# EAGLE design oshi-fuse-board-mk-1_mini-ato (EAGLE 6.5.0)
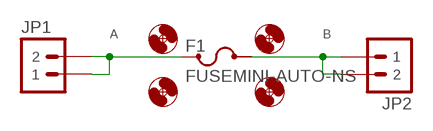
[diagram p0: schematic, sheet 1]

## Parts
F1  FUSEMINI-AUTO-NS  [KEYSTONE-MINI-AUTO-FUSE-HOLDER-NS]
H1  HOLE#2  [HOLE-#2]
H2  HOLE#2  [HOLE-#2]
H3  HOLE#2  [HOLE-#2]
H4  HOLE#2  [HOLE-#2]
JP1  M023.5MM  [SCREWTERMINAL-3.5MM-2]
JP2  M023.5MM  [SCREWTERMINAL-3.5MM-2]

## Nets
A: F1.P1@1 F1.P1@2 JP1.1 JP1.2
B: F1.P2@1 F1.P2@2 JP2.1 JP2.2

## Library data of the parts
F1 = A_butts:FUSE
H1-H4 = A_butts:HOLE: MOUNTING HOLE with drill center marker
JP1 JP2 = A_butts:M02: Standard 2-pin 0.1" header. Use with - straight break away headers ( PRT-00116) - right angle break away headers (PRT-00553) - swiss pins (PRT-00743) - machine pins (PRT-00117) - female headers (PRT-00115) Molex polarized connector foot print use with: PRT-08233 with associated crimp pins and housings. 2.54_SCREWTERM for use with PRT-10571. 3.5mm Screw Terminal footprints for PRT-08084 5mm Screw Terminal footprints for use with PRT-08433

## Board
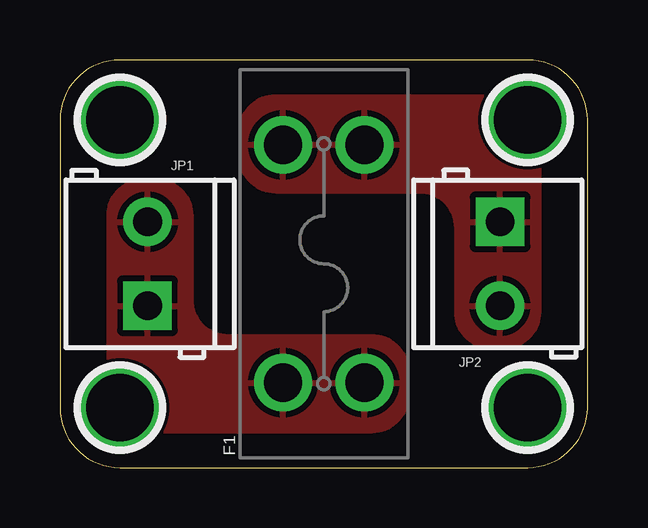
[diagram p1: board, top side]
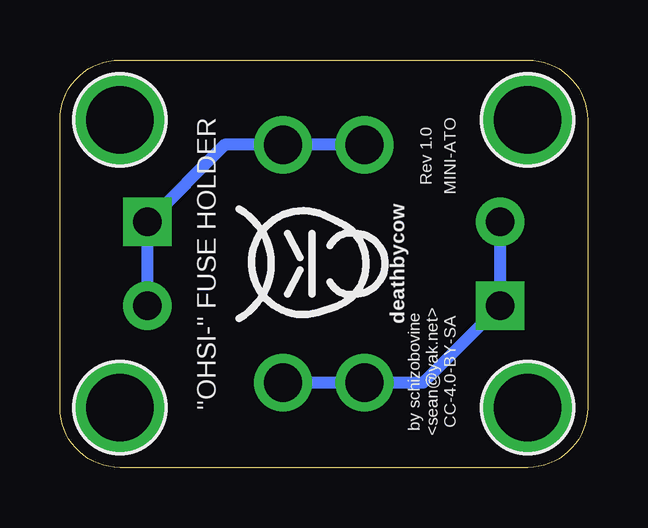
[diagram p2: board, bottom side, seen from below]

Size 22 x 17 mm. Coordinates in mm from the lower left corner, seen from the top.
Outline: 0,14.5 0,2.5 arc90 2.5,0 19.5,0 arc90 22,2.5 22,14.5 arc90 19.5,17 2.5,17 arc90 0,14.5
Copper layers (1*16): Top 0.0356mm / dielectric 1.5011mm / Bottom 0.0356mm
Design rules "LaenPCBOrder_2": minimum track width 6mil, minimum drill 13mil, track to track 6mil, track to pad 6mil, pad to pad 6mil, via to via 6mil, smd to smd 6mil, copper to edge 15mil, drill to drill 6mil, minimum pad ring 7mil, minimum via ring 7mil, stop-mask expansion 3mil, vias tented up to drill 20mil, thermal gap 10mil

### Footprints (pad centres in the part's own frame; a part is rotated, then mirrored left to right if it is on the bottom)
KEYSTONE-MINI-AUTO-FUSE-HOLDER-NS = drill 1.6: P1@1 -4.96,1.7; P1@2 -4.96,-1.7; P2@1 4.96,1.7; P2@2 4.96,-1.7
HOLE-#2 = drill 2.8 pad 3.81: P$1 0,0
SCREWTERMINAL-3.5MM-2 = drill 1.2 pad 2.032 square: 1 0,0 | drill 1.2 pad 2.032: 2 3.5,0

### Placement (x,y rotation side)
F1  11,8.5 90 top
H1  2.5,14.5 0 top
H2  19.5,14.5 0 top
H3  19.5,2.5 0 top
H4  2.5,2.5 0 top
JP1  3.65,6.75 90 top
JP2  18.35,10.25 270 top
U$1  [COW_SMALL]  12,8.5 90 bottom

### Tracks (layer width: path | path; a pad name or v marks a point on that pad's centre or on a via)
A
  Bottom 0.5: JP1.2 JP1.1 6.86,3.54 9,3.54 F1.P1@1 F1.P1@2
  pour Top: 14.5,4 14.5,3 arc-90 13,1.5 2,1.5 2,10.5 arc-90 3.5,12 4,12 arc-90 5.5,10.5 5.5,7 arc90 7,5.5 13,5.5 arc-90
B
  Bottom 0.5: F1.P2@1 F1.P2@2 15.14,13.46 JP2.1 JP2.2
  pour Top: 20,15.5 9,15.5 arc90 7.5,14 7.5,13 arc90 9,11.5 15,11.5 arc-90 16.5,10 16.5,6.5 arc90 18,5 18.5,5 arc90 20,6.5

### Text on the board
bPlace: MINI-ATO | Rev 1.0 | "OHSI-" FUSE HOLDER | CC-4.0-BY-SA | by schizobovine / <sean@yak.net>